# EAGLE design pan_tilt_laser_driver (EAGLE 7.0.0)
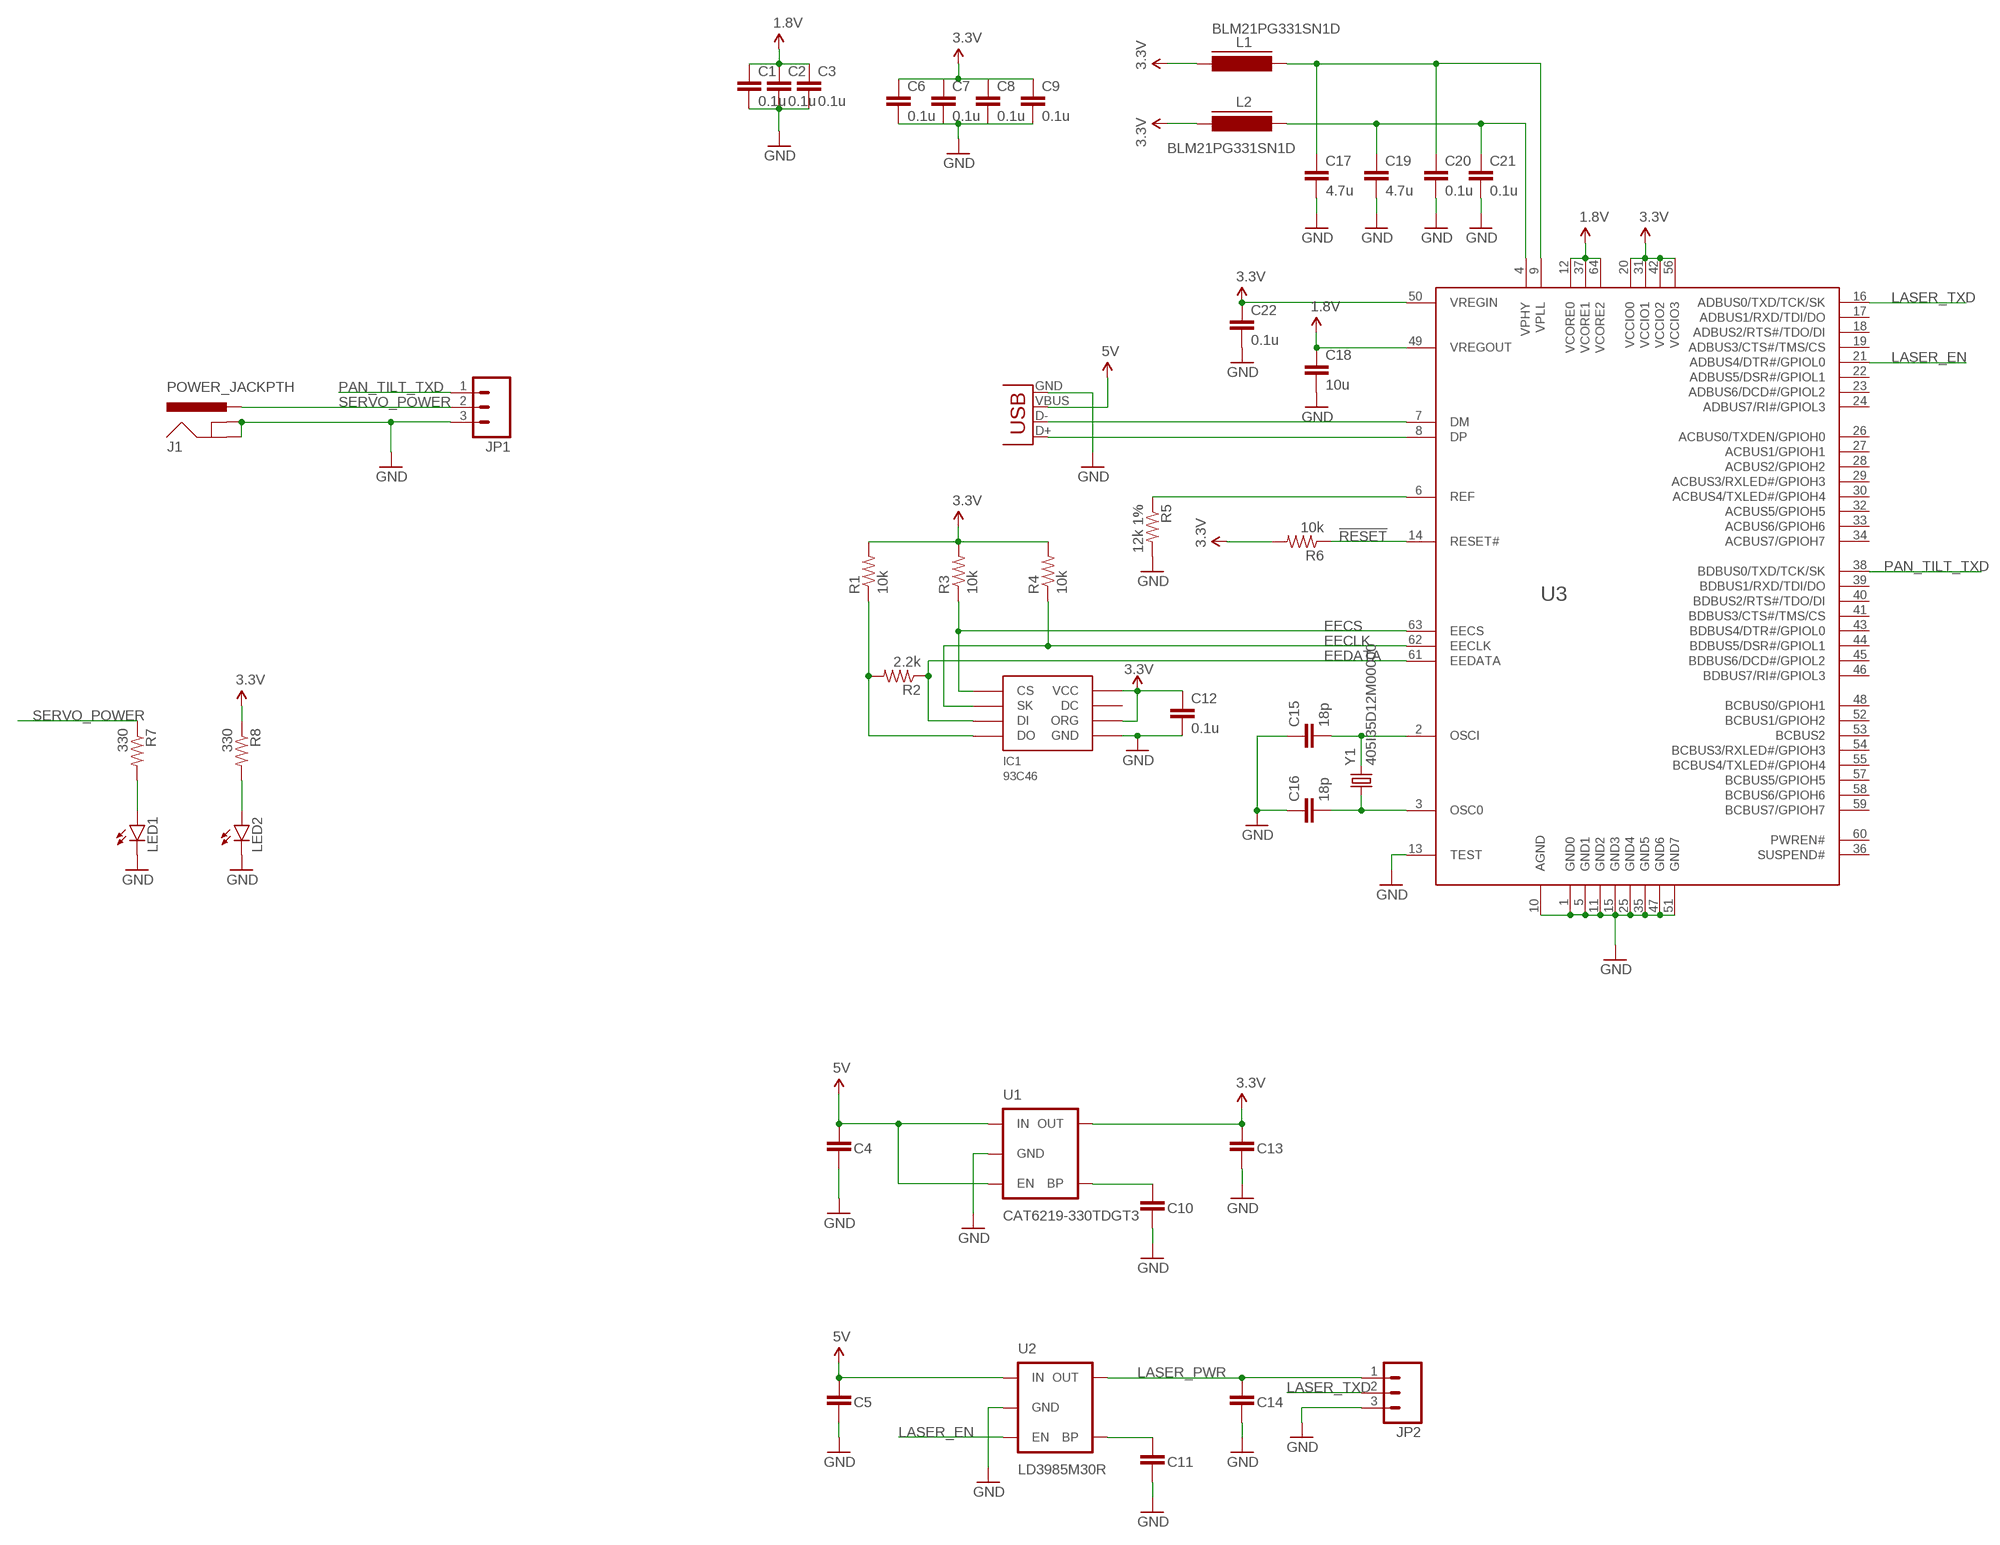
[diagram p0: schematic, sheet 1]

## Parts
C1  0.1u  C-EUC0603K  [C0603K]
C2  0.1u  C-EUC0603K  [C0603K]
C3  0.1u  C-EUC0603K  [C0603K]
C4  10u  CAP0603-CAP  [0603-CAP]
C5  10u  CAP0603-CAP  [0603-CAP]
C6  0.1u  C-EUC0603K  [C0603K]
C7  0.1u  C-EUC0603K  [C0603K]
C8  0.1u  C-EUC0603K  [C0603K]
C9  0.1u  C-EUC0603K  [C0603K]
C10  0.01u  CAP0603-CAP  [0603-CAP]
C11  0.01u  CAP0603-CAP  [0603-CAP]
C12  0.1u  C-EUC0603K  [C0603K]
C13  10u  CAP0603-CAP  [0603-CAP]
C14  10u  CAP0603-CAP  [0603-CAP]
C15  18p  C-EUC0603K  [C0603K]
C16  18p  C-EUC0603K  [C0603K]
C17  4.7u  C-EUC0603K  [C0603K]
C18  10u  C-EUC0603K  [C0603K]
C19  4.7u  C-EUC0603K  [C0603K]
C20  0.1u  C-EUC0603K  [C0603K]
C21  0.1u  C-EUC0603K  [C0603K]
C22  0.1u  C-EUC0603K  [C0603K]
IC1  93C46  [SOIC8]
J1  POWER_JACKPTH  [POWER_JACK_PTH]
JP1  M0322-03-5035  [22-03-5035]
JP2  651-5442251  M03SCREW  [SCREWTERMINAL-3.5MM-3]
L1  BLM21PG331SN1D  FERRITE_BEAD805  [FB805]
L2  BLM21PG331SN1D  FERRITE_BEAD805  [FB805]
LED1  LED1206  [LED-1206]
LED2  LED1206  [LED-1206]
R1  10k  R-US_R0603  [R0603]
R2  2.2k  R-US_R0603  [R0603]
R3  10k  R-US_R0603  [R0603]
R4  10k  R-US_R0603  [R0603]
R5  12k 1%  R-US_R0603  [R0603]
R6  10k  R-US_R0603  [R0603]
R7  330  R-US_R0603  [R0603]
R8  330  R-US_R0603  [R0603]
U1  CAT6219-330TDGT3  V_REG_MIC52195V  [SOT23-5]
U2  LD3985M30R  V_REG_MIC52195V  [SOT23-5]
U3  FT2232H  [LQFP64]
X1  538-47346-0001  USB-MICROB  [USB-MICROB]
Y1  405I35D12M00000  CRYSTAL5X3  [CRYSTAL-SMD-5X3]

## Nets
1.8V: C1.1 C2.1 C3.1 C18.1 U3.12(VCORE0) U3.37(VCORE1) U3.49(VREGOUT) U3.64(VCORE2)
3.3V [power]: C6.1 C7.1 C8.1 C9.1 C12.1 C13.1 C22.1 IC1.6(ORG) IC1.8(VCC) L1.2 L2.2 R1.2 R3.2 R4.2 R6.2 R8.1 U1.5(OUT) U3.20(VCCIO0) U3.31(VCCIO1) U3.42(VCCIO2) U3.50(VREGIN) U3.56(VCCIO3)
5V: C4.1 C5.1 U1.1(IN) U1.3(EN) U2.1(IN) X1.VBUS
!RESET: R6.1 U3.14(RESET#)
EECLK: IC1.2(SK) R4.1 U3.62(EECLK)
EECS: IC1.1(CS) R3.1 U3.63(EECS)
EEDATA: IC1.3(DI) R2.1 U3.61(EEDATA)
GND [power]: C1.2 C2.2 C3.2 C4.2 C5.2 C6.2 C7.2 C8.2 C9.2 C10.2 C11.2 C12.2 C13.2 C14.2 C15.1 C16.1 C17.2 C18.2 C19.2 C20.2 C21.2 C22.2 IC1.5(GND) J1.GND J1.GNDBREAK JP1.3 JP2.3 LED1.C LED2.C R5.2 U1.2(GND) U2.2(GND) U3.1(GND0) U3.5(GND1) U3.10(AGND) U3.11(GND2) U3.13(TEST) U3.15(GND3) U3.25(GND4) U3.35(GND5) U3.47(GND6) U3.51(GND7) X1.GND
LASER_EN: U2.3(EN) U3.21(ADBUS4/DTR#/GPIOL0)
LASER_PWR: C14.1 JP2.1 U2.5(OUT)
LASER_TXD: JP2.2 U3.16(ADBUS0/TXD/TCK/SK)
N$1: C11.1 U2.4(BP)
N$2: LED1.A R7.2
N$3: U3.7(DM) X1.D-
N$4: R5.1 U3.6(REF)
N$5: U3.8(DP) X1.D+
N$6: C17.1 C20.1 L1.1 U3.9(VPLL)
N$7: C15.2 U3.2(OSCI) Y1.3
N$8: C10.1 U1.4(BP)
N$9: C19.1 C21.1 L2.1 U3.4(VPHY)
N$10: C16.2 U3.3(OSC0) Y1.1
N$11: LED2.A R8.2
N$45: IC1.4(DO) R1.1 R2.2
PAN_TILT_TXD: JP1.1 U3.38(BDBUS0/TXD/TCK/SK)
SERVO_POWER: J1.PWR JP1.2 R7.1
Unconnected: IC1.7(DC) U3.17(ADBUS1/RXD/TDI/DO) U3.18(ADBUS2/RTS#/TDO/DI) U3.19(ADBUS3/CTS#/TMS/CS) U3.22(ADBUS5/DSR#/GPIOL1) U3.23(ADBUS6/DCD#/GPIOL2) U3.24(ADBUS7/RI#/GPIOL3) U3.26(ACBUS0/TXDEN/GPIOH0) U3.27(ACBUS1/GPIOH1) U3.28(ACBUS2/GPIOH2) U3.29(ACBUS3/RXLED#/GPIOH3) U3.30(ACBUS4/TXLED#/GPIOH4) U3.32(ACBUS5/GPIOH5) U3.33(ACBUS6/GPIOH6) U3.34(ACBUS7/GPIOH7) U3.36(SUSPEND#) U3.39(BDBUS1/RXD/TDI/DO) U3.40(BDBUS2/RTS#/TDO/DI) U3.41(BDBUS3/CTS#/TMS/CS) U3.43(BDBUS4/DTR#/GPIOL0) U3.44(BDBUS5/DSR#/GPIOL1) U3.45(BDBUS6/DCD#/GPIOL2) U3.46(BDBUS7/RI#/GPIOL3) U3.48(BCBUS0/GPIOH1) U3.52(BCBUS1/GPIOH2) U3.53(BCBUS2) U3.54(BCBUS3/RXLED#/GPIOH3) U3.55(BCBUS4/TXLED#/GPIOH4) U3.57(BCBUS5/GPIOH5) U3.58(BCBUS6/GPIOH6) U3.59(BCBUS7/GPIOH7) U3.60(PWREN#)

## Library data of the parts
C1-C3 C6-C9 C12 C15-C22 = rcl:C-EU: CAPACITOR, European symbol
C4 C5 C10 C11 C13 C14 = SparkFun-Passives:CAP: Capacitor Standard 0603 ceramic capacitor, and 0.1" leaded capacitor.
IC1 = dp_devices:93C46; 93C46: 93C46
J1 = SparkFun-Connectors:POWER_JACK: Power Jack This is the standard 5.5mm barrel jack for power. The PTH is the most common, proven, reliable, footprint. The Slot footprint only works if the mill layer is transmitted to the PCB fab house so be warned. Mating wall wart : TOL-00298 (and others); PROD_ID: PRT-00119
JP1 = torpedo:M03: Header 3 Standard 3-pin 0.1" header. Use with straight break away headers (SKU : PRT-00116), right angle break away headers (PRT-00553), swiss pins (PRT-00743), machine pins (PRT-00117), and female headers (PRT-00115). Molex polarized connector foot print use with SKU : PRT-08232 with associated crimp pins and housings.
JP2 = SparkFun-Connectors:M03: Header 3 Standard 3-pin 0.1" header. Use with straight break away headers (SKU : PRT-00116), right angle break away headers (PRT-00553), swiss pins (PRT-00743), machine pins (PRT-00117), and female headers (PRT-00115). Molex polarized connector foot print use with SKU : PRT-08232 with associated crimp pins and housings.
L1 L2 = dp_devices:FERRITE_BEAD
LED1 LED2 = SparkFun-LED:LED: LEDs Standard schematic elements and footprints for 5mm, 3mm, 1206, and 0603 sized LEDs. 5mm - Spark Fun Electronics SKU : COM-00529 (and others)
R1-R8 = rcl:R-US_: RESISTOR, American symbol
U1 U2 = SparkFun-PowerIC:V_REG_MIC5219: V_REG MIC5219 Standard 3.3V and 5V 500mA LDO voltage regulator in SOT-23 layout. Micrel part MIC5219. BP (by-pass) pin is used to lower output noise with 470pF cap, may be left open.; PROD_ID: VREG-10107; VALUE: MIC5219 5V
U3 = torpedo:FT2232H: DUAL HIGH SPEED USB TO MULTIPURPOSE UART/FIFO IC
X1 = SparkFun:USB: USB Connectors USB-B-PTH is fully proven SKU : PRT-00139 USB-miniB is fully proven SKU : PRT-00587 USB-A-PCB is untested. USB-A-H is throughly reviewed, but untested. Spark Fun Electronics SKU : PRT-00437 USB-B-SMT is throughly reviewed, but untested. Needs silkscreen touching up. USB-A-S has not been used/tested USB-MB-H has not been used/tested
Y1 = SparkFun-FreqCtrl:CRYSTAL: Various standard crystals. Proven footprints. Spark Fun Electronics SKU : COM-00534

## Net classes
1 power: width 0.254 mm

## Board
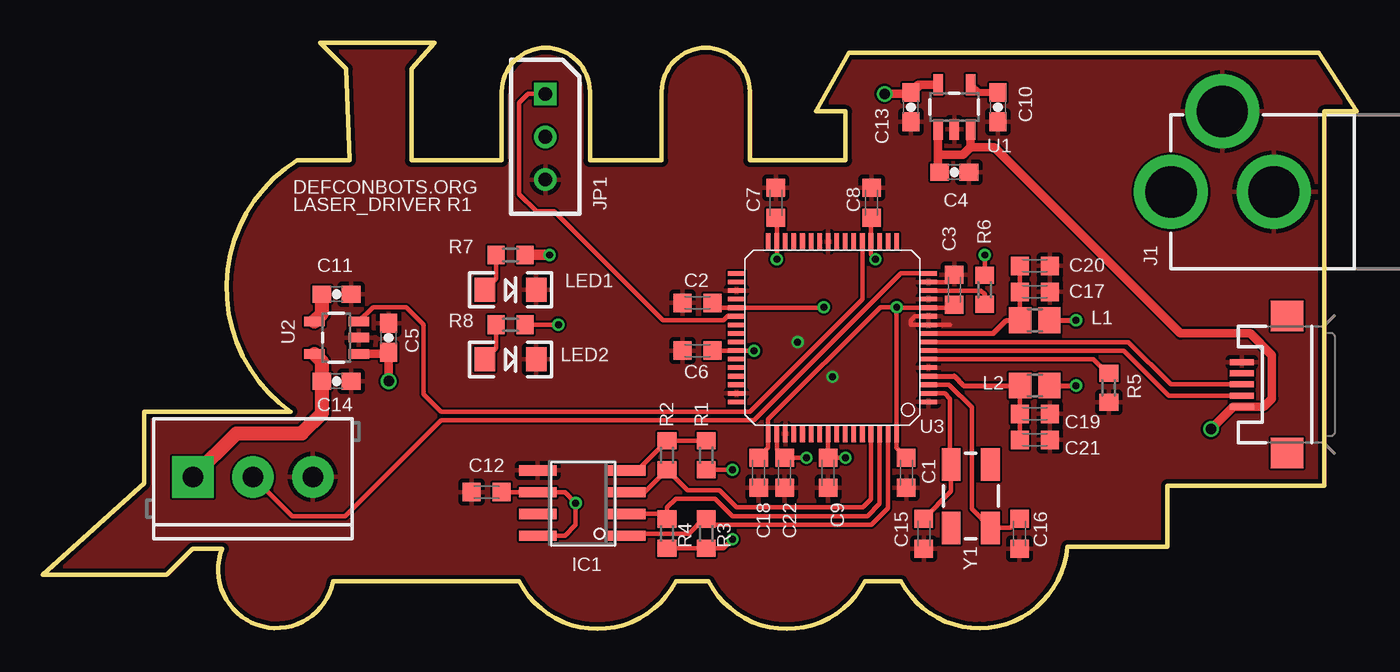
[diagram p1: board, top side]
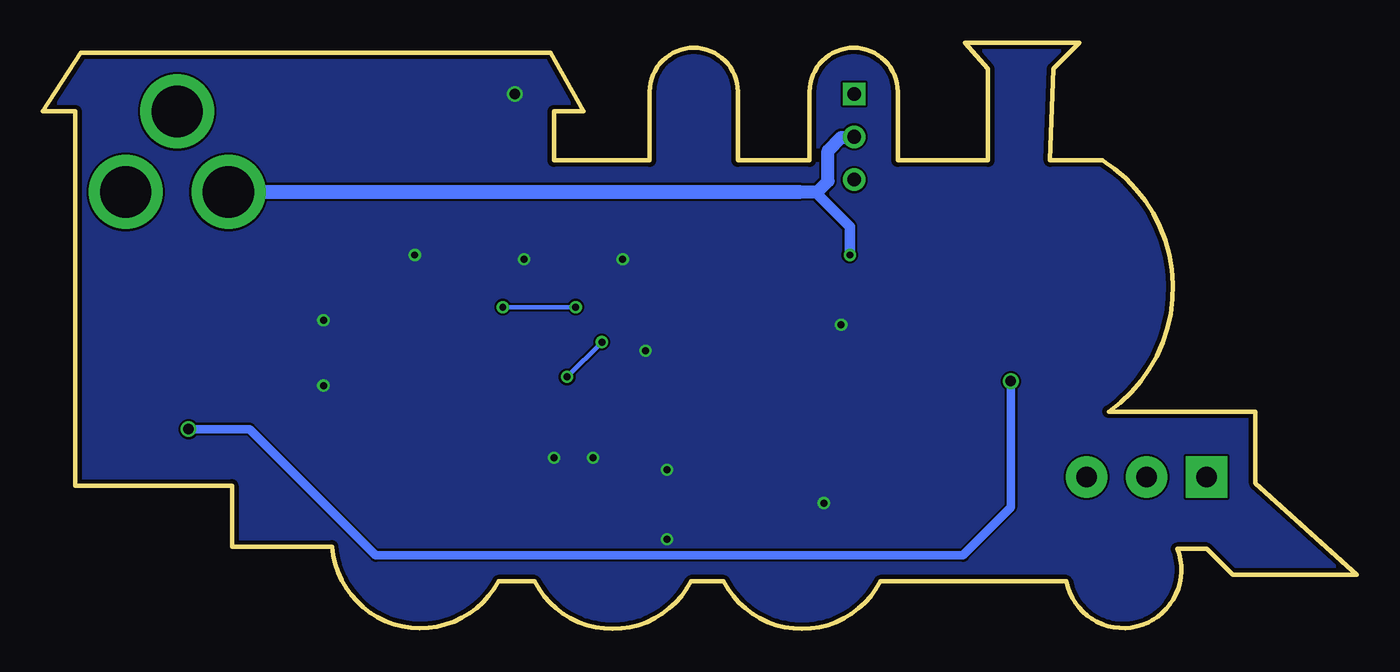
[diagram p2: board, bottom side, seen from below]

Size 76.71 x 34.21 mm. Coordinates in mm from the lower left corner, seen from the top.
Outline: 0,3.15 5.91,8.49 5.91,12.68 14.48,12.68 arc-113 14.86,27.35 17.91,27.35 17.72,32.68 16.19,34.21 22.86,34.21 21.53,32.68 21.53,27.35 26.8,27.35 26.8,31.35 arc-180 31.94,31.35 31.94,27.35 36.13,27.35 36.13,31.35 arc-180 41.27,31.35 41.27,27.35 46.86,27.35 46.86,30.21 45.15,30.21 47.05,33.63 74.49,33.63 76.71,30.21 74.8,30.21 74.8,8.36 65.66,8.36 65.66,4.81 59.82,4.81 arc-147 50.1,2.77 48.01,2.77 arc-125 38.86,2.77 36.96,2.77 arc-125 27.81,2.77 16.95,2.77 arc-190 10.48,4.68 8.76,4.68 7.24,3.15 0,3.15
Copper layers (1*16): Top 0.035mm / dielectric 1.5mm / Bottom 0.035mm
Design rules "dirt_cheap_dirty_boards.v1": minimum track width 5mil, minimum drill 12mil, track to track 5mil, track to pad 5mil, pad to pad 5mil, via to via 5mil, smd to smd 0mil, copper to edge 10mil, drill to drill 10mil, minimum pad ring 10mil, minimum via ring 6mil, stop-mask expansion 2mil, vias tented up to drill 25mil, thermal gap 10mil

### Footprints (pad centres in the part's own frame; a part is rotated, then mirrored left to right if it is on the bottom)
C0603K = smd 1.05 x 1.08: 1 -0.875,0; 2 0.875,0
0603-CAP = smd 1.1 x 1: 1 -0.85,0; 2 0.85,0
SOIC8 = smd 0.6 x 2.2: 1 -1.905,-2.6; 2 -0.635,-2.6; 3 0.635,-2.6; 4 1.905,-2.6; 5 1.905,2.6; 6 0.635,2.6; 7 -0.635,2.6; 8 -1.905,2.6
POWER_JACK_PTH = drill 2.997 pad 4.318: GND 0,7.7; GNDBREAK 4.7,10.7; PWR 0,13.7
22-03-5035 = drill 0.8 square: 1 0,0 | drill 0.8: 2 2.5,0; 3 5,0
SCREWTERMINAL-3.5MM-3 = drill 1.2 pad 2.413 square: 1 0,0 | drill 1.2 pad 2.413: 2 3.5,0; 3 7,0
FB805 = smd 1.3 x 1.5: 1 -0.85,0; 2 0.85,0
LED-1206 = smd 1.2 x 1.4: A -1.5,0; C 1.5,0
R0603 = smd 1 x 1.1: 1 -0.85,0; 2 0.85,0
SOT23-5 = smd 0.55 x 1.2: 1 -0.95,-1.3; 2 0,-1.3; 3 0.95,-1.3; 4 0.95,1.3; 5 -0.95,1.3
LQFP64 = smd 1 x 0.27: 1 -5.6,3.75; 2 -5.6,3.25; 3 -5.6,2.75; 4 -5.6,2.25; 5 -5.6,1.75; 6 -5.6,1.25; 7 -5.6,0.75; 8 -5.6,0.25; 9 -5.6,-0.25; 10 -5.6,-0.75; 11 -5.6,-1.25; 12 -5.6,-1.75; 13 -5.6,-2.25; 14 -5.6,-2.75; 15 -5.6,-3.25; 16 -5.6,-3.75; 33 5.6,-3.75; 34 5.6,-3.25; 35 5.6,-2.75; 36 5.6,-2.25; 37 5.6,-1.75; 38 5.6,-1.25; 39 5.6,-0.75; 40 5.6,-0.25; 41 5.6,0.25; 42 5.6,0.75; 43 5.6,1.25; 44 5.6,1.75; 45 5.6,2.25; 46 5.6,2.75; 47 5.6,3.25; 48 5.6,3.75 | smd 0.27 x 1: 17 -3.75,-5.6; 18 -3.25,-5.6; 19 -2.75,-5.6; 20 -2.25,-5.6; 21 -1.75,-5.6; 22 -1.25,-5.6; 23 -0.75,-5.6; 24 -0.25,-5.6; 25 0.25,-5.6; 26 0.75,-5.6; 27 1.25,-5.6; 28 1.75,-5.6; 29 2.25,-5.6; 30 2.75,-5.6; 31 3.25,-5.6; 32 3.75,-5.6; 49 3.75,5.6; 50 3.25,5.6; 51 2.75,5.6; 52 2.25,5.6; 53 1.75,5.6; 54 1.25,5.6; 55 0.75,5.6; 56 0.25,5.6; 57 -0.25,5.6; 58 -0.75,5.6; 59 -1.25,5.6; 60 -1.75,5.6; 61 -2.25,5.6; 62 -2.75,5.6; 63 -3.25,5.6; 64 -3.75,5.6
USB-MICROB = smd 0.35 x 1.4: D+ 0,2.65; D- -0.65,2.65; GND 1.3,2.65; ID 0.65,2.65; VBUS -1.3,2.65 | smd 1.8 x 1.9: MT1 -4,0; MT2 4,0
CRYSTAL-SMD-5X3 = smd 1.9 x 1.1: 1 -1.85,-1.15; 2 1.85,-1.15; 3 1.85,1.15; 4 -1.85,1.15

### Placement (x,y rotation side)
C1  50.42,9.12 270 top
C2  38.23,19.03 180 top
C3  53.21,19.79 90 top
C4  53.21,26.65 0 top
C5  20.19,17 90 top
C6  38.23,16.24 180 top
C7  42.8,24.87 90 top
C8  48.39,24.87 90 top
C9  45.85,9.12 270 top
C10  55.75,30.46 270 top
C11  17.14,19.54 0 top
C12  25.91,7.98 180 top
C13  50.67,30.46 270 top
C14  17.14,14.46 0 top
C15  51.44,5.57 90 top
C16  57.02,5.57 90 top
C17  57.91,19.66 0 top
C18  41.78,9.12 270 top
C19  57.91,12.55 0 top
C20  57.91,21.19 0 top
C21  57.91,11.03 0 top
C22  43.31,9.12 270 top
IC1  31.5,7.35 90 top
J1  79.57,25.51 90 top
JP1  29.34,31.22 270 top
JP2  8.76,8.87 0 top
L1  57.91,18.01 0 top
L2  57.91,14.2 0 top
LED1  27.3,19.79 0 top
LED2  27.3,15.73 0 top
R1  38.73,10.14 270 top
R2  36.45,10.14 90 top
R3  38.73,5.57 270 top
R4  36.45,5.57 270 top
R5  62.23,14.08 270 top
R6  54.99,19.79 90 top
R7  27.3,21.82 180 top
R8  27.3,17.76 180 top
U1  53.21,30.46 0 top
U2  17.14,17 90 top
U3  46.1,17 180 top
X1  72.64,14.27 90 top
Y1  54.18,7.75 90 top

### Tracks (layer width: path | path; a pad name or v marks a point on that pad's centre or on a via)
1.8V  (via drill 0.41)
  Top 0.254: C1.1 49.85,10.57 U3.64 49.85,18.72 | C2.1 39.38,18.75 U3.37 45.56,18.75 v45.59,18.78 | C3.1 53.04,18.75 U3.12 49.88,18.75 49.85,18.72 | 49.85,18.72 v49.85,18.78 48.9,18.78 42.35,12.23 U3.49 42.35,10.57 C18.1
  Top 0.406: 52.79,18.75 C3.1
  Bottom 0.254: v45.59,18.78 v49.85,18.78
3.3V  (via drill 0.41, 0.61)
  Top 0.254: C8.1 48.35,23.96 U3.20 48.35,21.86 48.39,21.82 v48.6,21.57 | C7.1 42.85,23.94 U3.31 v42.85,21.57 | C6.1 39.1,16.25 U3.42 41.52,16.25 v41.53,16.24 | C12.1 IC1.6 30.48,7.98 v31.12,7.35 31.12,6.08 30.48,5.44 IC1.8 | R4.2 R3.2 39.75,4.72 v40.26,5.23 | R1.2 v40.26,9.29 | U3.56 C9.1 v46.86,10 | R6.2 v54.99,21.82 | U3.50 42.85,10.45 C22.1 v44.58,10 | R8.1 v30.1,17.76
  Top 0.305: L2.2 v60.33,14.2 | L1.2 v60.33,18.01
  Top 0.508: C13.1 51.12,31.76 U1.5 51.21,31.76 50.67,31.22 v49.15,31.22
  pour Bottom: -2.16,38.08 77.85,38.08 77.85,-3.32 -2.16,-3.32
5V  (via drill 0.61)
  Top 0.508: C4.1 52.26,26.75 52.26,27.67 | 52.26,27.67 U1.1 | U1.3 54.16,28.11 | 54.16,28.11 53.72,27.67 52.26,27.67 | 54.16,28.11 55.56,28.11 66.42,17.25 70.48,17.25 71.75,15.98 71.75,13.44 71.28,12.97 X1.VBUS 69.5,12.97 v68.2,11.66 | U2.1 20.09,16.05 C5.1 v20.19,14.46
  Bottom 0.508: v20.19,14.46 20.19,7.09 22.99,4.3 57.28,4.3 64.64,11.66 v68.2,11.66
!RESET
  Top 0.254: U3.14 54.78,19.75 54.99,19.54 R6.1
EECLK
  Top 0.254: U3.62 48.85,7.3 48.13,6.58 40.26,6.58 39.24,7.6 36.96,7.6 36.45,7.09 R4.1 36.16,6.71 IC1.2
EECS
  Top 0.254: IC1.1 35.05,5.44 35.18,5.57 37.72,5.57 38.57,6.42 R3.1 39.08,6.08 48.39,6.08 49.35,7.04 U3.63
EEDATA
  Top 0.254: IC1.3 35.14,7.98 R2.1 37.63,8.11 39.5,8.11 40.51,7.09 47.88,7.09 48.35,7.56 U3.61
GND  (via drill 0.41)
  Top 0.254: C3.2 52.79,20.25 U3.15 | U3.11 50.91,18.25 50.67,18.01 50.67,17.76 52.96,17.76
  Bottom 0.254: v44.07,16.74 v46.1,14.71
  pour Top: 0.13,39.1 81.92,39.1 81.92,-2.56 0.13,-2.56
LASER_EN
  Top 0.254: U2.3 19.27,18.78 21.21,18.78 22.23,17.76 22.23,13.7 23.24,12.68 41.27,12.68 47.85,19.26 U3.21
LASER_PWR
  Top 0.813: U2.5 16.29,15.6 C14.1 16.29,12.59 15.11,11.41 11.3,11.41 JP2.1
LASER_TXD
  Top 0.254: U3.16 50.1,20.75 41.53,12.17 23.24,12.17 17.65,6.58 14.55,6.58 JP2.2
N$1
  Top 0.813: U2.4 16.29,18.4 C11.1
N$2
  Top 0.254: R7.2 26.46,20.44 LED1.A
N$3
  Top 0.254: U3.7 51.71,16.24 63.12,16.24 65.74,13.62 X1.D-
N$4
  Top 0.254: U3.6 51.72,15.73 61.34,15.73 62.14,14.93 R5.1
N$5
  Top 0.254: U3.8 63.37,16.74 65.85,14.27 X1.D+
N$6
  Top 0.254: L1.1 57.04,17.78 C17.1 C20.1
  Top 0.305: U3.9 55.49,17.25 56.26,18.01 L1.1
N$7
  Top 0.254: U3.2 52.65,13.75 52.96,13.44 52.96,9.67 Y1.3 53.03,8.04 C15.2
N$8
  Top 0.406: U1.4 54.61,31.31 C10.1
N$9
  Top 0.254: L2.1 57.04,14.18 C19.1 C21.1
  Top 0.305: U3.4 53.22,14.75 53.76,14.2 L2.1
N$10
  Top 0.254: U3.3 52.91,14.25 54.23,12.93 54.23,7 Y1.1 56.48,5.9 C16.2
N$11
  Top 0.254: R8.2 26.46,16.38 LED2.A
N$45
  Top 0.254: IC1.4 34.71,9.25 R2.2 R1.1
PAN_TILT_TXD
  Top 0.254: U3.38 40.48,18.27 40.01,18.27 39.75,18.01 36.2,18.01 29.84,24.36 28.83,24.36 27.81,25.38 27.81,30.71 28.32,31.22 JP1.1
SERVO_POWER  (via drill 0.41)
  Top 0.61: R7.1 v29.59,21.82
  Bottom 0.406: 29.38,28.68 29.34,28.68 JP1.2
  Bottom 0.61: v29.59,21.82 29.59,23.47 31.62,25.51
  Bottom 0.762: 32.55,25.51 31.62,25.51 31.5,25.51 30.86,26.14 30.86,27.92 30.1,28.68 29.38,28.68
  Bottom 0.813: J1.PWR 32.55,25.51

### Text on the board
tPlace: DEFCONBOTS.ORG | LASER_DRIVER R1